# EasyEDA schematic 1-Schematic_DenGiaoThong.json
TITLE: Sheet_1; REV: 1.0; Date: 2024-05-22; Sheet: 1/1; Drawn By: quocnguyenpro921; Company: Your Company
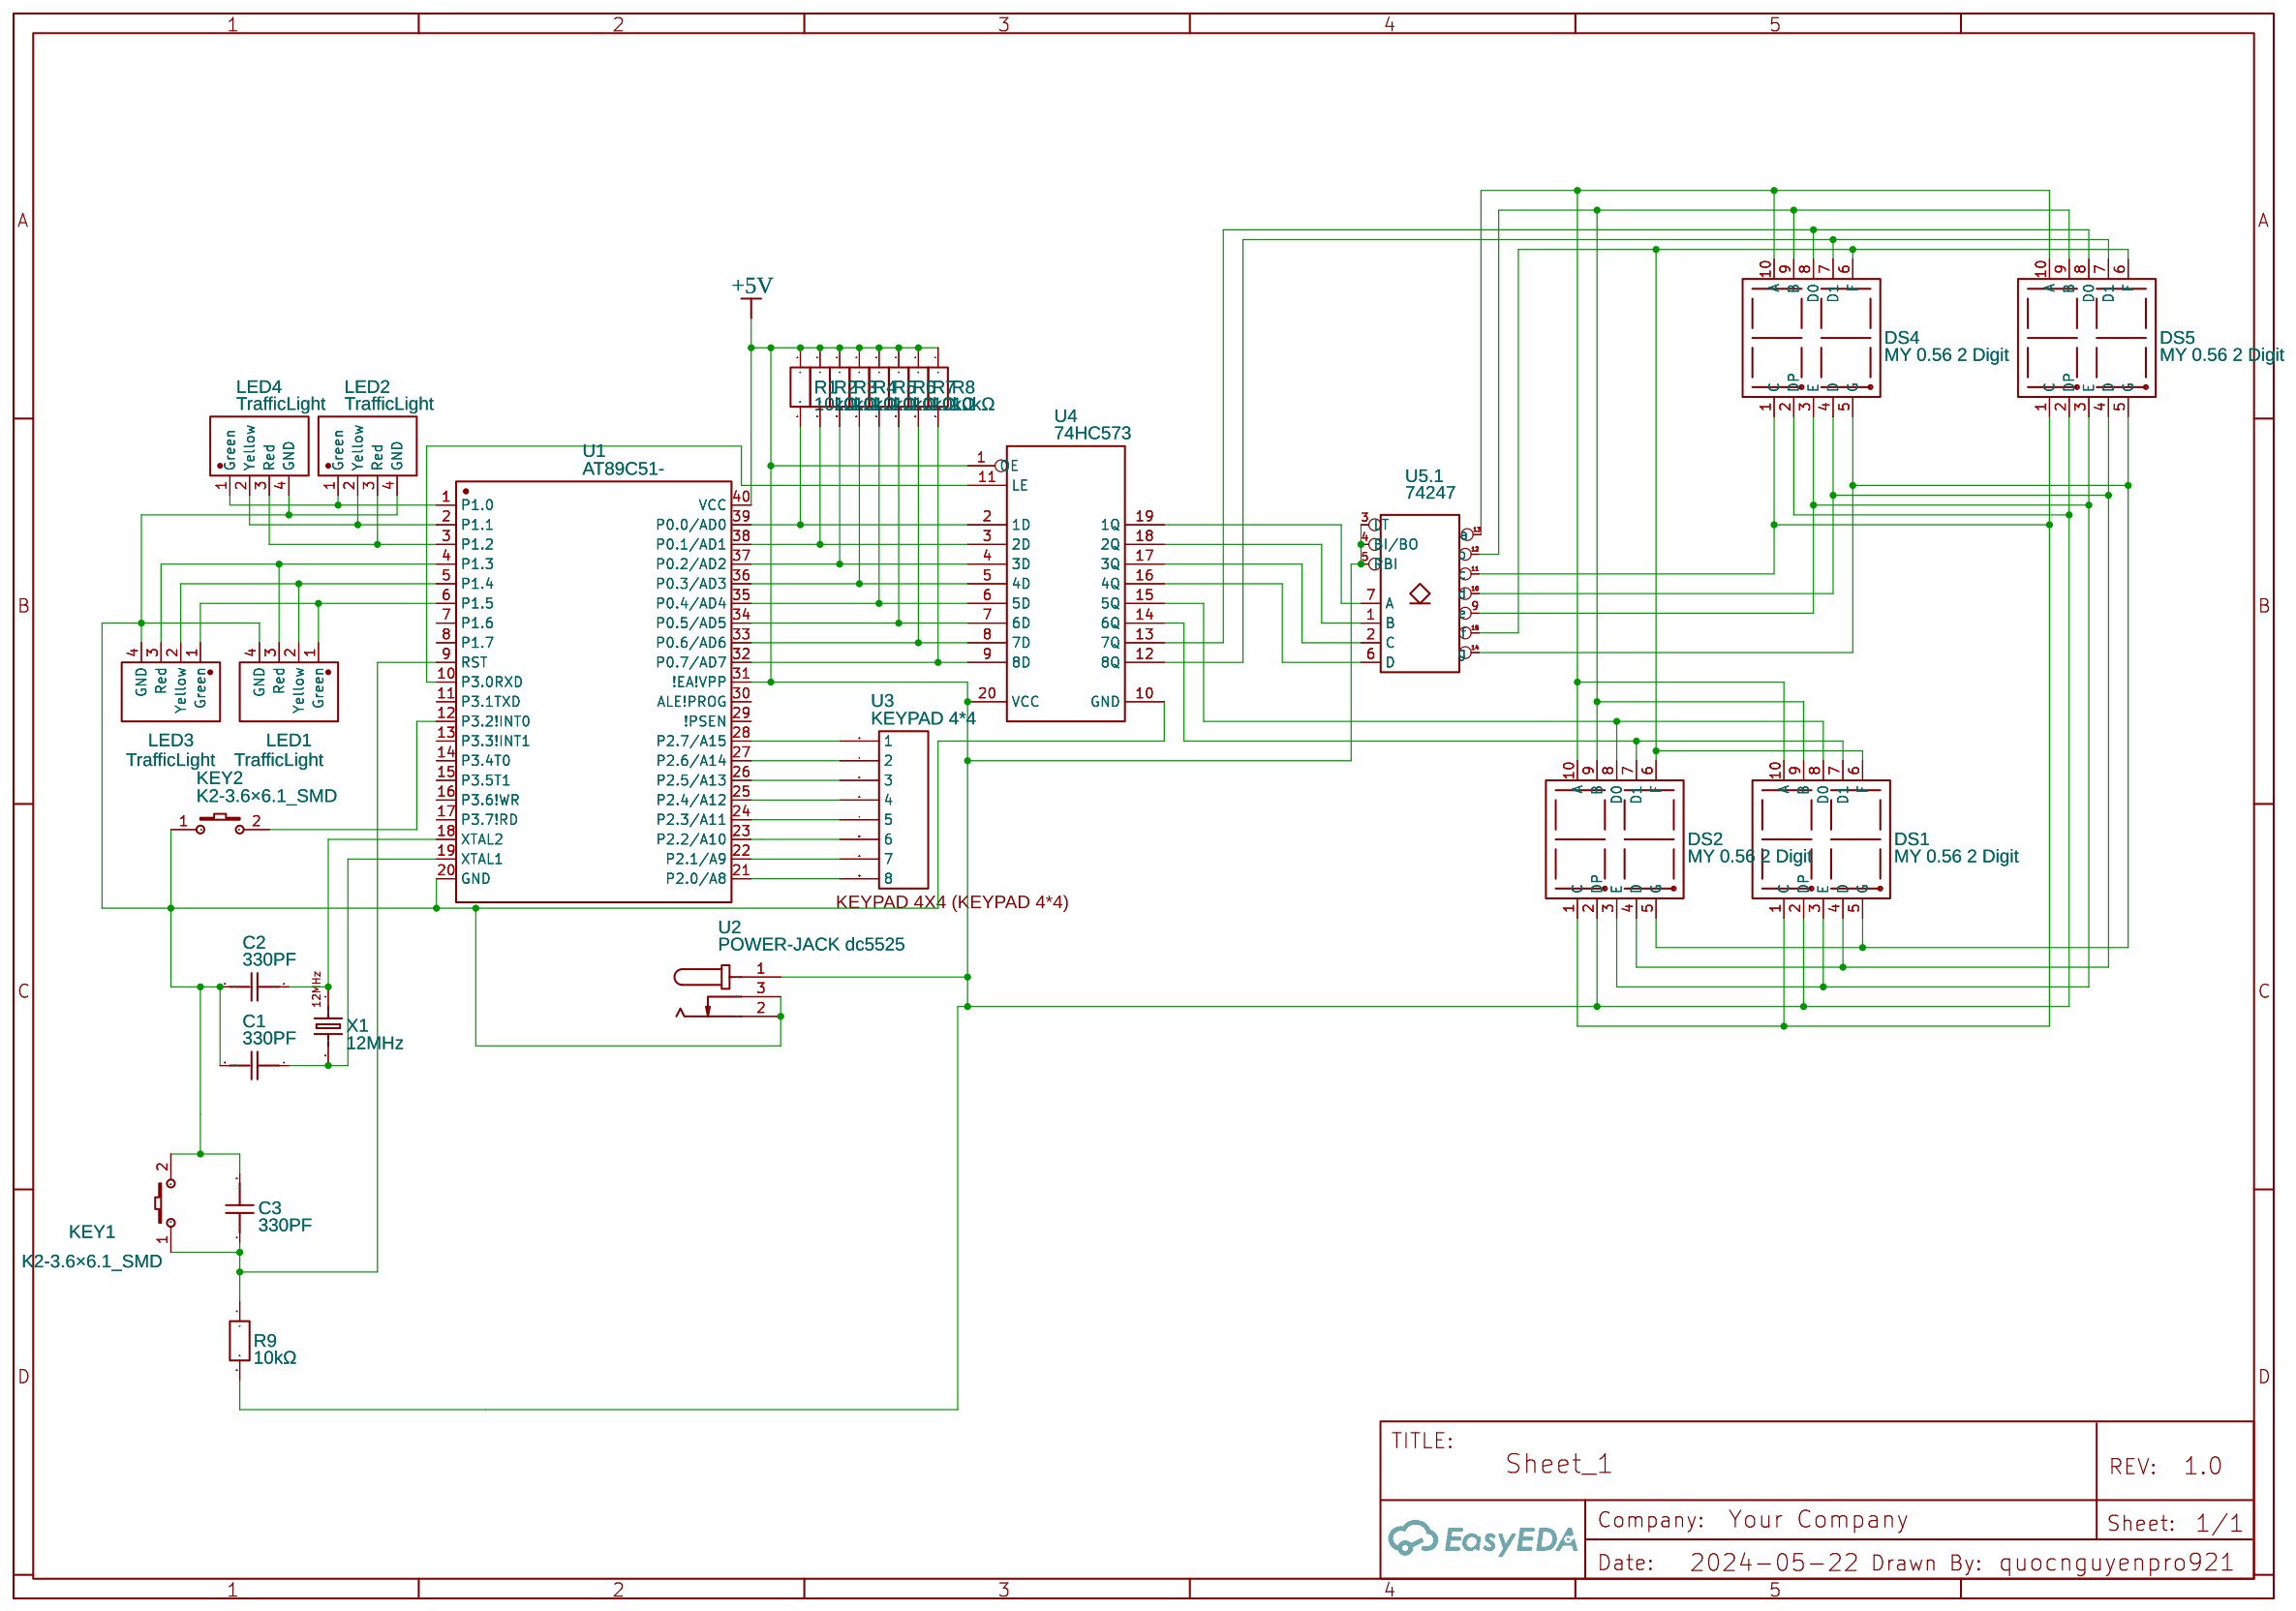
[diagram p0: schematic sheet]

## Parts
C1  330PF  [330PF]
C2  330PF  [330PF]
C3  330PF  [330PF]
DS1  MY 0.56 2 Digit  [MY 0.56 2 DIGIT]
DS2  MY 0.56 2 Digit  [MY 0.56 2 DIGIT]
DS4  MY 0.56 2 Digit  [MY 0.56 2 DIGIT]
DS5  MY 0.56 2 Digit  [MY 0.56 2 DIGIT]
KEY1  K2-3.6×6.1_SMD  [KEY-SMD_2P-L6.2-W3.6-LS8.0]
KEY2  K2-3.6×6.1_SMD  [KEY-SMD_2P-L6.2-W3.6-LS8.0]
LED1  TrafficLight  [TRAFFIC LIGHT SENSOR MODULE]
LED2  TrafficLight  [TRAFFIC LIGHT SENSOR MODULE]
LED3  TrafficLight  [TRAFFIC LIGHT SENSOR MODULE]
LED4  TrafficLight  [TRAFFIC LIGHT SENSOR MODULE]
R1  10kΩ  [RES-TH_BD2.7-L6.2-P10.20-D0.4]
R2  10kΩ  [RES-TH_BD2.7-L6.2-P10.20-D0.4]
R3  10kΩ  [RES-TH_BD2.7-L6.2-P10.20-D0.4]
R4  10kΩ  [RES-TH_BD2.7-L6.2-P10.20-D0.4]
R5  10kΩ  [RES-TH_BD2.7-L6.2-P10.20-D0.4]
R6  10kΩ  [RES-TH_BD2.7-L6.2-P10.20-D0.4]
R7  10kΩ  [RES-TH_BD2.7-L6.2-P10.20-D0.4]
R8  10kΩ  [RES-TH_BD2.7-L6.2-P10.20-D0.4]
R9  10kΩ  [RES-TH_BD2.7-L6.2-P10.20-D0.4]
U1  AT89C51-  [DIP40]
U2  POWER-JACK dc5525  [DC-IN-TH_POWER-JACK]
U3  KEYPAD 4*4  [KEYPAD 4X4 (KEYPAD 4*4)]
U4  74HC573  [DIP20]
U5  74247  [DIP-16]  (section 1)
X1  12MHz  [QRES 12MHZ]

## Library data of the parts
C1-C3 = 330PF: Contributor: Omar Murguia
DS1 DS2 DS4 DS5 = MY 0.56 2 Digit: Manufacturer Part: 0.56 Inch 4 Digit Common Anode 7 Segment Display Clock; Contributor: joe5656123
KEY1 KEY2 = K2-3.6×6.1_SMD: Supplier Part: C118141; Supplier: LCSC; Manufacturer Part: K2-1107ST-A4SW-06; Contributor: LCEDA_Lib; 制造商: 韩国韩荣
LED1-LED4 = TrafficLight: link: https://www.aliexpress.com/item/1005003304113500.html?spm=a2g0o.order_list.0.0.6d181802yehZpG; Contributor: smaroulis
R1-R9 = CR1/4W-10K±5%-ST52: Supplier: LCSC; Supplier Part: C2894649; Manufacturer: VO(翔胜); link: https://atta.szlcsc.com/upload/public/pdf/source/20210803/C2857407_45FF53FE186CAB545115AD37303966CD.pdf; Contributor: rafaelscortes; JLCPCB Part Class: Extended Part
U1 = AT89C51-
U2 = POWER-JACK dc5525: Supplier: LCSC; Supplier Part: C9900001795; Manufacturer: null; Manufacturer Part: POWER-JACK; JLCPCB Part Class: Extended Part; Contributor: LCSC
U3 = KEYPAD 4*4: Contributor: baanaan76182; Package Display: Yes
U4 = 74HC573: Octal Transparent Latches with 3-State Outputs; sourceId: HDLFXRK2k
U5 = 74247: Contributor: John.Frank; subpart_no: 1
X1 = qres 12MHZ: Supplier: LCSC; Manufacturer: TAE; Manufacturer Part: HC-49S12MHz20pF30PPM; Contributor: LCSC; Supplier Part: C127674; LCSC Assembly: Yes; SMT Type: Extend

## Nets
+5V: DS1.2(DP) DS2.2(DP) DS4.2(DP) DS5.2(DP) R1.1 R2.1 R3.1 R4.1 R5.1 R6.1 R7.1 R8.1 R9.2 U1.31(!EA!VPP) U1.40(VCC) U2.1 U4.1(OE) U4.20(VCC) U5.3(LT) U5.4(BI/BO) U5.5(RBI)
Net-(C1-1): C1.1 U1.19(XTAL1) X1.2
Net-(C1-2): C1.2 C2.2 C3.2 KEY1.2 KEY2.1 LED1.4(GND) LED2.4(GND) LED3.4(GND) LED4.4(GND) U1.20(GND) U2.2 U2.3 U4.10(GND)
Net-(C2-1): C2.1 U1.18(XTAL2) X1.1
Net-(C3-1): C3.1 KEY1.1 R9.1 U1.9(RST)
Net-(DS1-1): DS1.1(C) DS2.1(C) DS4.1(C) DS5.1(C) U5.11(c)
Net-(DS1-3): DS1.3(E) DS2.3(E) DS4.3(E) DS5.3(E) U5.9(e)
Net-(DS1-4): DS1.4(D) DS2.4(D) DS4.4(D) DS5.4(D) U5.10(d)
Net-(DS1-5): DS1.5(G) DS2.5(G) DS4.5(G) DS5.5(G) U5.14(g)
Net-(DS1-6): DS1.6(F) DS2.6(F) DS4.6(F) DS5.6(F) U5.15(f)
Net-(DS1-7): DS1.7(D1) DS2.7(D1) U4.14(6Q)
Net-(DS1-8): DS1.8(D0) DS2.8(D0) U4.15(5Q)
Net-(DS1-9): DS1.9(B) DS2.9(B) DS4.9(B) DS5.9(B) U5.12(b)
Net-(DS1-10): DS1.10(A) DS2.10(A) DS4.10(A) DS5.10(A) U5.13(a)
Net-(DS4-7): DS4.7(D1) DS5.7(D1) U4.12(8Q)
Net-(DS4-8): DS4.8(D0) DS5.8(D0) U4.13(7Q)
Net-(KEY2-2): KEY2.2 U1.12(P3.2!INT0)
Net-(LED1-1): LED1.1(Green) LED3.1(Green) U1.6(P1.5)
Net-(LED1-2): LED1.2(Yellow) LED3.2(Yellow) U1.5(P1.4)
Net-(LED1-3): LED1.3(Red) LED3.3(Red) U1.4(P1.3)
Net-(LED2-1): LED2.1(Green) LED4.1(Green) U1.1(P1.0)
Net-(LED2-2): LED2.2(Yellow) LED4.2(Yellow) U1.2(P1.1)
Net-(LED2-3): LED2.3(Red) LED4.3(Red) U1.3(P1.2)
Net-(R1-2): R1.2 U1.39(P0.0/AD0) U4.2(1D)
Net-(R2-2): R2.2 U1.38(P0.1/AD1) U4.3(2D)
Net-(R3-2): R3.2 U1.37(P0.2/AD2) U4.4(3D)
Net-(R4-2): R4.2 U1.36(P0.3/AD3) U4.5(4D)
Net-(R5-2): R5.2 U1.35(P0.4/AD4) U4.6(5D)
Net-(R6-2): R6.2 U1.34(P0.5/AD5) U4.7(6D)
Net-(R7-2): R7.2 U1.33(P0.6/AD6) U4.8(7D)
Net-(R8-2): R8.2 U1.32(P0.7/AD7) U4.9(8D)
Net-(U1-10): U1.10(P3.0RXD) U4.11(LE)
Net-(U1-21): U1.21(P2.0/A8) U3.10(8)
Net-(U1-22): U1.22(P2.1/A9) U3.9(7)
Net-(U1-23): U1.23(P2.2/A10) U3.8(6)
Net-(U1-24): U1.24(P2.3/A11) U3.7(5)
Net-(U1-25): U1.25(P2.4/A12) U3.6(4)
Net-(U1-26): U1.26(P2.5/A13) U3.5(3)
Net-(U1-27): U1.27(P2.6/A14) U3.4(2)
Net-(U1-28): U1.28(P2.7/A15) U3.3(1)
Net-(U4-16): U4.16(4Q) U5.6(D)
Net-(U4-17): U4.17(3Q) U5.2(C)
Net-(U4-18): U4.18(2Q) U5.1(B)
Net-(U4-19): U4.19(1Q) U5.7(A)

Not connected (* = marked no-connect by the designer): U1 7(P1.6) 8(P1.7) 11(P3.1TXD) 13(P3.3!INT1) 14(P3.4T0) 15(P3.5T1) 16(P3.6!WR) 17(P3.7!RD) 29(!PSEN) 30(ALE!PROG)
